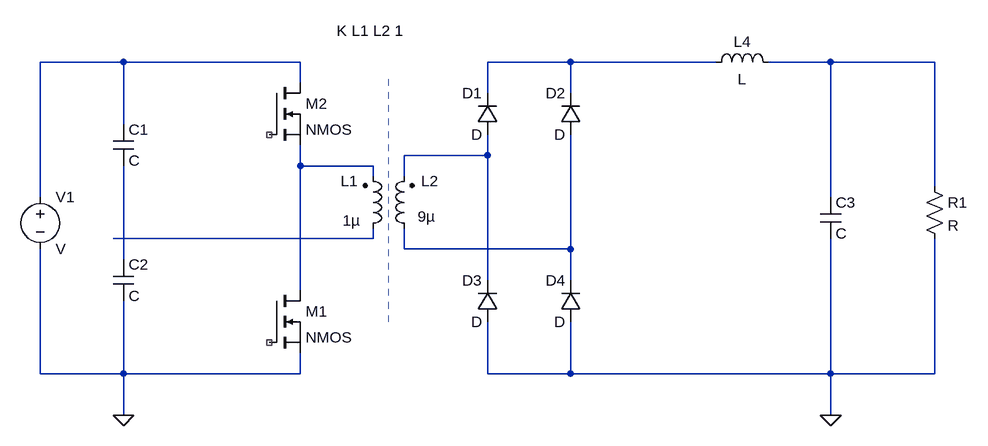
[diagram p0: schematic Halfbridge.asc]
Halfbridge.asc, the LTspice schematic file:
Version 4
SHEET 1 1628 680
WIRE 240 -96 112 -96
WIRE 512 -96 240 -96
WIRE 928 -96 800 -96
WIRE 1152 -96 928 -96
WIRE 1328 -96 1232 -96
WIRE 1488 -96 1328 -96
WIRE 512 -64 512 -96
WIRE 800 -48 800 -96
WIRE 928 -48 928 -96
WIRE 240 0 240 -96
WIRE 800 48 800 16
WIRE 800 48 672 48
WIRE 512 64 512 32
WIRE 624 64 512 64
WIRE 624 80 624 64
WIRE 672 80 672 48
WIRE 1488 96 1488 -96
WIRE 112 112 112 -96
WIRE 1328 112 1328 -96
WIRE 624 176 624 160
WIRE 624 176 224 176
WIRE 672 192 672 160
WIRE 928 192 928 16
WIRE 928 192 672 192
WIRE 240 208 240 64
WIRE 800 240 800 48
WIRE 928 240 928 192
WIRE 512 256 512 64
WIRE 112 384 112 192
WIRE 240 384 240 272
WIRE 240 384 112 384
WIRE 512 384 512 352
WIRE 512 384 240 384
WIRE 800 384 800 304
WIRE 928 384 928 304
WIRE 928 384 800 384
WIRE 1328 384 1328 176
WIRE 1328 384 928 384
WIRE 1488 384 1488 176
WIRE 1488 384 1328 384
WIRE 240 448 240 384
WIRE 1328 448 1328 384
FLAG 1328 448 0
FLAG 240 448 0
SYMBOL voltage 112 96 R0
SYMATTR InstName V1
SYMBOL cap 224 0 R0
SYMATTR InstName C1
SYMBOL cap 224 208 R0
SYMATTR InstName C2
SYMBOL nmos 464 256 R0
SYMATTR InstName M1
SYMBOL nmos 464 -64 R0
SYMATTR InstName M2
SYMBOL ind2 608 176 M180
WINDOW 0 -34 89 Left 2
WINDOW 3 -31 28 Left 2
SYMATTR InstName L1
SYMATTR Value 1µ
SYMATTR Type ind
SYMBOL ind2 688 176 R180
WINDOW 0 -37 89 Left 2
WINDOW 3 -32 34 Left 2
SYMATTR InstName L2
SYMATTR Value 9µ
SYMATTR Type ind
SYMBOL ind 1136 -80 R270
WINDOW 0 32 56 VTop 2
WINDOW 3 5 56 VBottom 2
SYMATTR InstName L4
SYMBOL cap 1312 112 R0
SYMATTR InstName C3
SYMBOL res 1472 80 R0
SYMATTR InstName R1
SYMBOL diode 816 16 R180
WINDOW 0 24 64 Left 2
WINDOW 3 24 0 Left 2
SYMATTR InstName D1
SYMBOL diode 944 16 R180
WINDOW 0 24 64 Left 2
WINDOW 3 24 0 Left 2
SYMATTR InstName D2
SYMBOL diode 816 304 R180
WINDOW 0 24 64 Left 2
WINDOW 3 24 0 Left 2
SYMATTR InstName D3
SYMBOL diode 944 304 R180
WINDOW 0 24 64 Left 2
WINDOW 3 24 0 Left 2
SYMATTR InstName D4
TEXT 568 -144 Left 2 !K L1 L2 1
LINE Normal 648 304 648 -80 2

The netlist it stands for:
* Halfbridge.asc
V1 N001 0 V
C1 N001 N008 C
C2 N008 0 C
M1 N005 NC_01 0 0 NMOS
M2 N001 NC_02 N005 N005 NMOS
L1 N006 N005 1µ
L2 N007 N004 9µ
L4 N002 N003 L
C3 N003 0 C
R1 N003 0 R
D1 N004 N002 D
D2 N007 N002 D
D3 0 N004 D
D4 0 N007 D
.model D D
.lib standard.dio
.model NMOS NMOS
.model PMOS PMOS
.lib standard.mos
K L1 L2 1
.backanno
.end